# EasyEDA Pro project ProProject_12v转5v稳压_2024-07-26.epro

# Schematic Schematic1
Create Date: 2024-07-26; Page Name: P1; Project Name: 12v转5v稳压; Schematic Name: Schematic1; Update Date: 2024-07-26; Company: 嘉立创EDA; Page Size: A4; Version: V1.0
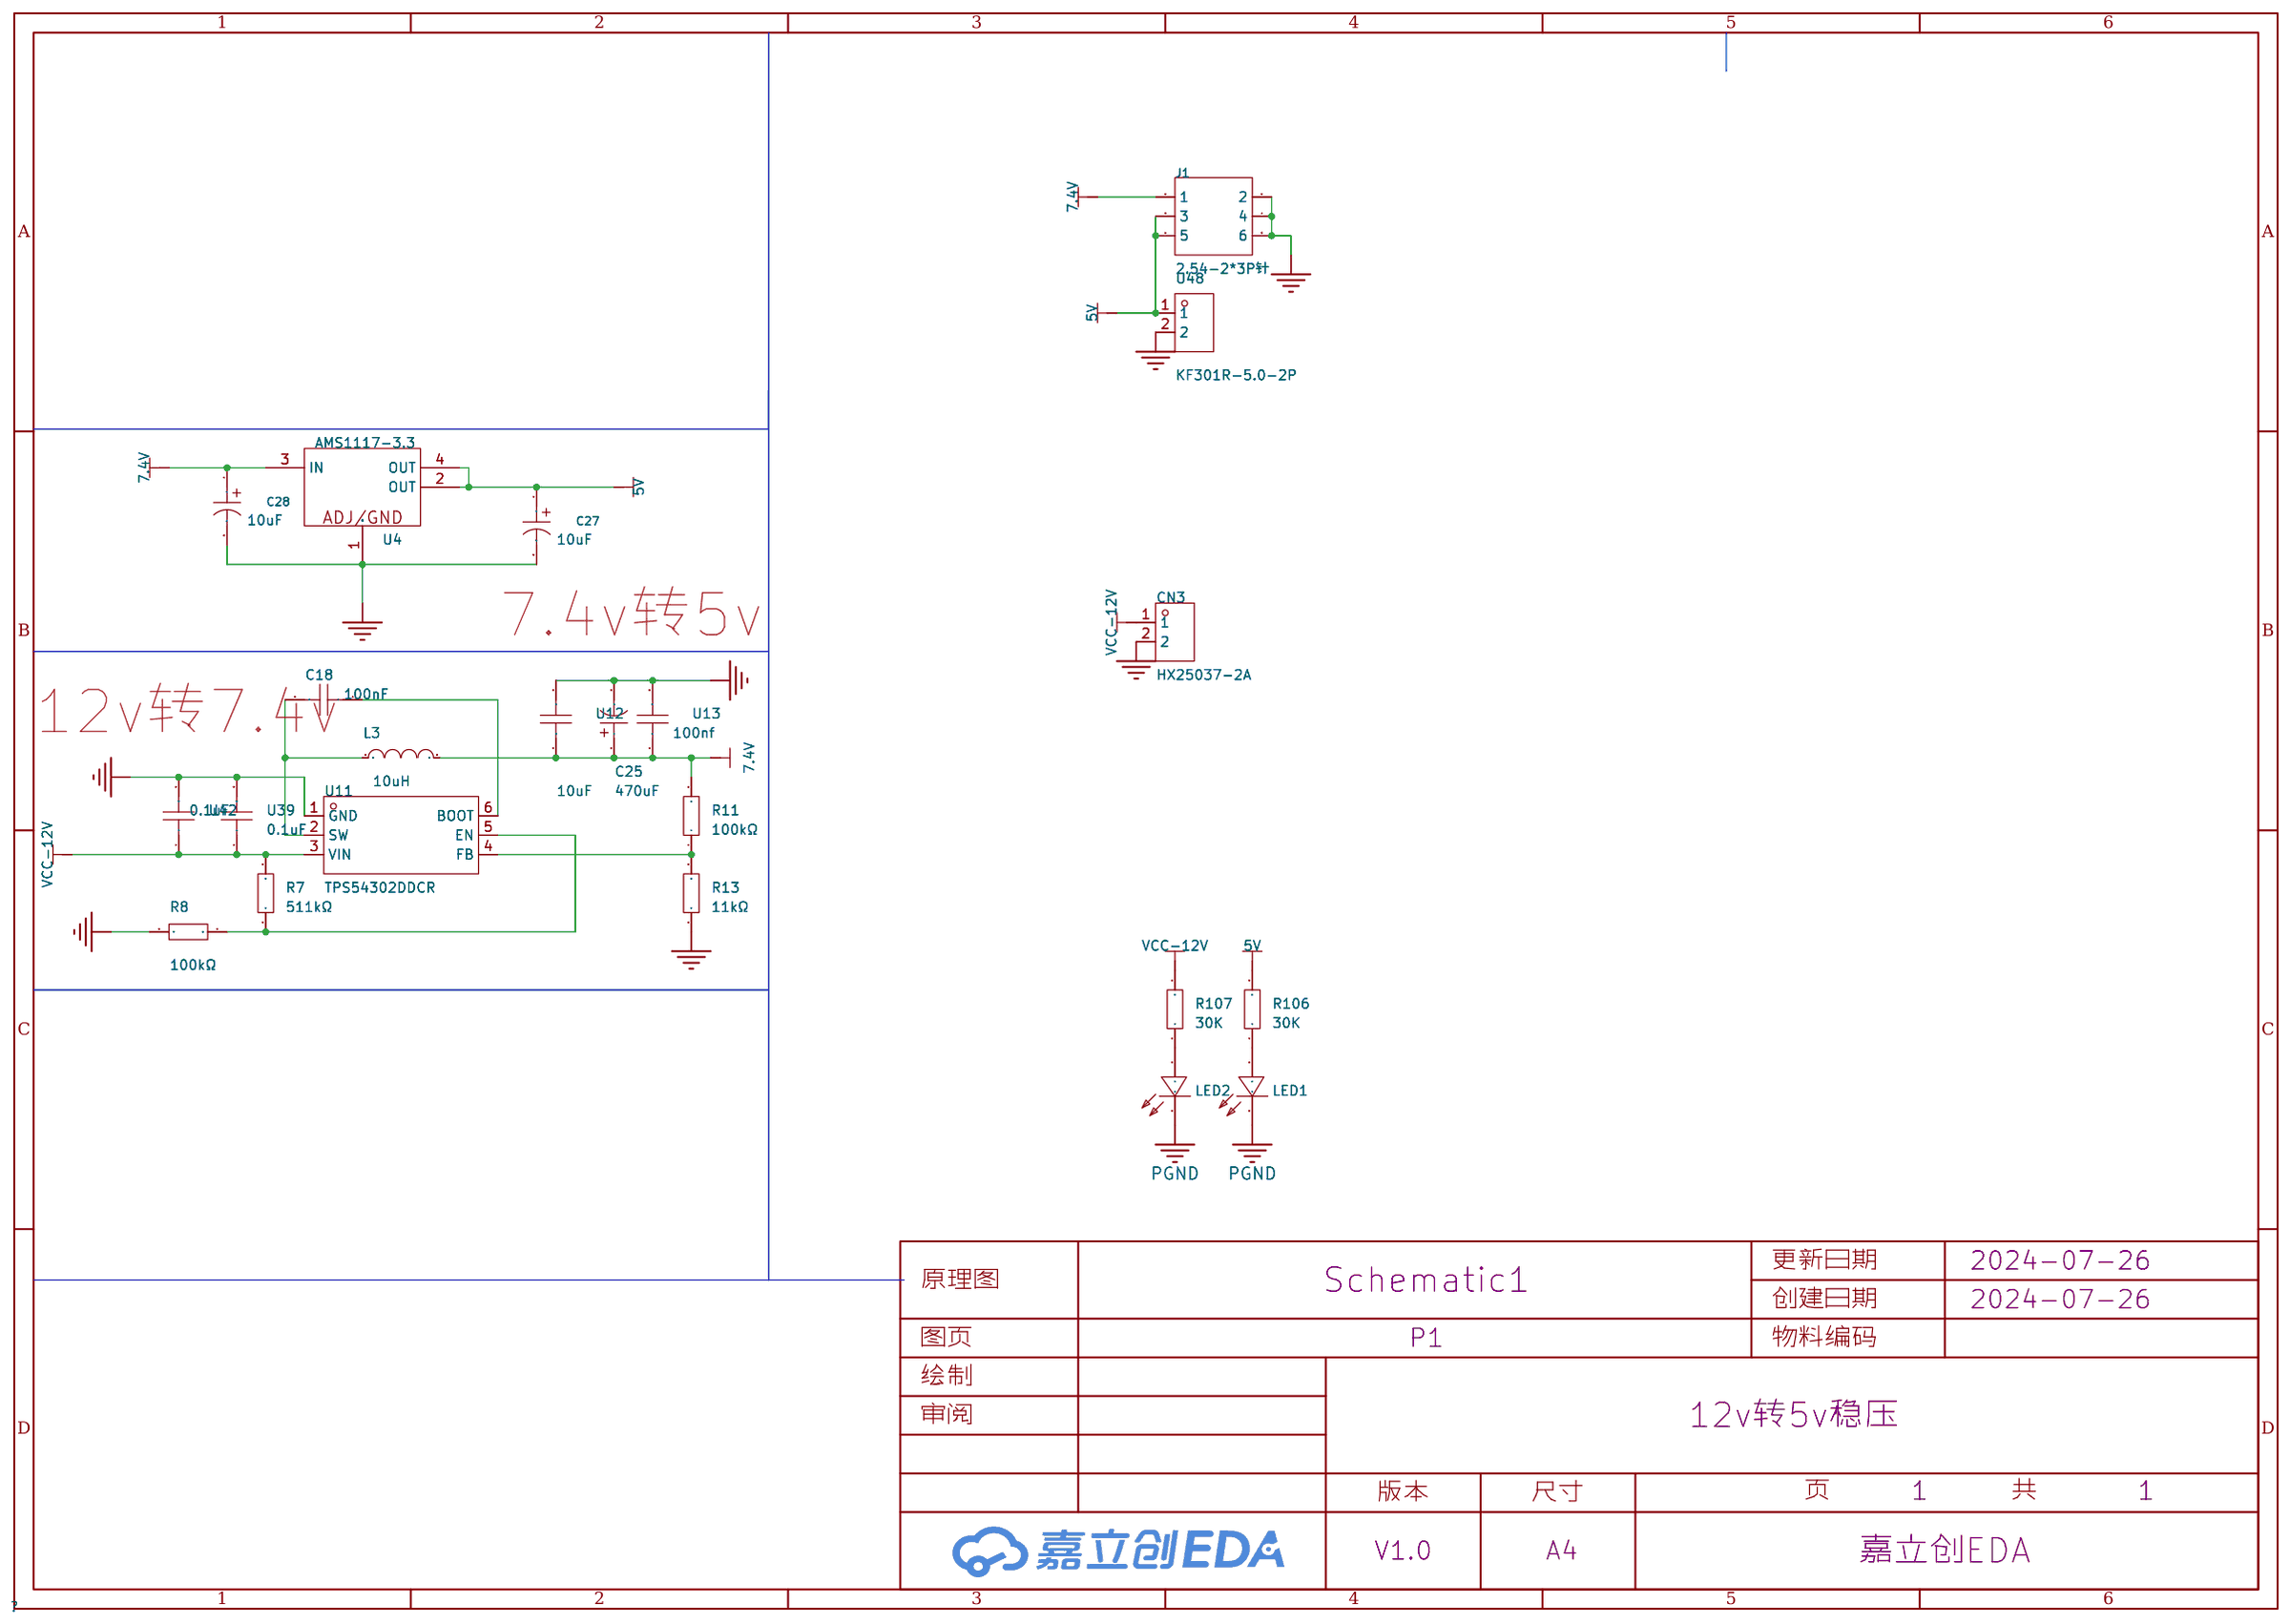
[diagram p0: schematic sheet]

## Parts
C18  100nF  [C0603]
C25  470uF  [CAP-SMD_BD10.0-L10.3-W10.3-LS11.3-FD]
C27  10uF  [CAP-SMD_L1.6-W0.9-FD]
C28  10uF  [CAP-SMD_L1.6-W0.9-FD]
CN3  HX25037-2A  [CONN-TH_2P-P2.50-XH2.54-2P]
J1  2.54-2*3P针  [HDR-TH_6P-P2.54-V-M-R2-C3-S2.54-1]
L3  10uH  [IND-SMD_L5.4-W5.2_FXL0530]
LED1  NCD0603R3  [LED0603-R-RD_RED]
LED2  NCD0603R3  [LED0603-R-RD_RED]
R7  511kΩ  [R0603]
R8  100kΩ  [R0603]
R11  100kΩ  [R0603]
R13  11kΩ  [R0603]
R106  30K  [R0603]
R107  30K  [R0603]
U4  AMS1117-3.3  [SOT-223-3_L6.4-W3.5-P2.30-LS7.0-BR]
U11  TPS54302DDCR  [SOT-23-6_L2.9-W1.6-P0.95-LS2.8-BL]
U12  10uF  [C0603]
U13  100nf  [C0603]
U39  0.1uF  [C0603]
U42  0.1uF  [C0603]
U48  KF301R-5.0-2P  [CONN-TH_P5.00_KF301R-5.0-2P]

## Library data of the parts
C18 = CC0603KRX7R9BB104: 容值:100nF;精度:±10%;额定电压:50V;材质(温度系数):X7R;; LCSC Part Name: 100nF ±10% 50V; Supplier Part: C14663; Manufacturer: YAGEO(国巨); Supplier Footprint: 0603; JLCPCB Part Class: 基础库; Datasheet: https://atta.szlcsc.com/upload/public/pdf/source/20170116/1484561234239.pdf; Supplier: LCSC; Tolerance: ±10%; Voltage Rated: 50V; Temperature Coefficient: X7R
C25 = XT470UF35V90RV0080: 容值:470uF;额定电压:35V;电容体直径:-;电容体长度:-;纹波电流:-;等效串联电阻:-;工作寿命:-;; LCSC Part Name: 470uF 35V; Supplier Part: C2992611; Manufacturer: KNSCHA(科尼盛); Supplier Footprint: SMD,D10xL10.5mm; JLCPCB Part Class: 扩展库; Datasheet: https://atta.szlcsc.com/upload/public/pdf/source/20220628/C969EE689908AD9C2F3DF9F92FD62901.pdf; Supplier: LCSC; Rated Voltage: 35V
C27 C28 = TCM1A106M8R: 容值:10uF;精度:±20%;额定电压:10V;等效串联电阻:9Ω;; LCSC Part Name: 10uF ±20% 10V; Supplier Part: C962635; Manufacturer: ROHM(罗姆); Supplier Footprint: 0603; JLCPCB Part Class: 扩展库; Datasheet: https://atta.szlcsc.com/upload/public/pdf/source/20201126/C962635_8046D3B05AD53548D8FD41E170F2F4AB.pdf; Supplier: LCSC; Tolerance: ±20%; Rated Voltage: 10V; Equivalent Series Resistance(ESR): 9Ω; Operating Temperature: -55℃~+125℃
CN3 = HX25037-2A: Supplier Part: C9900012767; Supplier Footprint: XHB2.54-2P; JLCPCB Part Class: 扩展库; Supplier: LCSC
J1 = 2.54-2*3P针: 插针结构:-;间距:2.54mm;行距:-;圆针/方针:-;安装类型:直插;排数:双排;总PIN位数:6P;额定电流:-;额定电压:-;配合针长度:-;塑高:-;触头材质:-;触头镀层:-;颜色:黑色;; LCSC Part Name: 间距:2.54mm 直插; Supplier Part: C65114; Manufacturer: BOOMELE(博穆精密); Supplier Footprint: 插件,P=2.54mm; JLCPCB Part Class: 扩展库; Supplier: LCSC; Pitch: 2.54mm; Mounting Type: 直插; Number of Rows: 双排; Number of Pins: 6P; Color: 黑色
L3 = FXL0530-4R7-M: 电感值:4.7uH;精度:±20%;额定电流:4.5A;饱和电流(Isat):5A;直流电阻(DCR):50mΩ;; LCSC Part Name: 4.7uH ±20% 4.5A 50mΩ; Supplier Part: C177246; Manufacturer: cjiang(长江微电); Supplier Footprint: SMD,5.4x5.2x2.8mm; JLCPCB Part Class: 扩展库; Datasheet: https://atta.szlcsc.com/upload/public/pdf/source/20190322/C177246_D81D0671B72FD9DE4B58607F480A6AE0.pdf; Supplier: LCSC; Tolerance: ±20%; Rated Current: 4.5A; Saturation Current (Isat): 5A; DC Resistance (DCR): 50mΩ
LED1 LED2 = NCD0603R3: 尺寸1.6x0.8x0.8；IF=20ma：1.6~2.6v，620~640nm,51~150mcd金线，光强高，功耗低，可靠性好，寿命长; LCSC Part Name: 红色;贴片LED;0603红灯;; Supplier Part: C3151730; Manufacturer: 国星光电; Supplier Footprint: 0603; JLCPCB Part Class: 扩展库; Datasheet: https://atta.szlcsc.com/upload/public/pdf/source/20220704/CBFF28C1847A97213A75929E60B7DDE7.pdf; Supplier: LCSC
R7 = RS-03K5113FT: 电阻类型:厚膜电阻;阻值:511kΩ;精度:±1%;功率:100mW;最大工作电压:50V;温度系数:±100ppm/℃;; LCSC Part Name: 厚膜电阻 511kΩ ±1% 100mW; Supplier Part: C321933; Manufacturer: FH(风华); Supplier Footprint: 0603; JLCPCB Part Class: 扩展库; Datasheet: https://atta.szlcsc.com/upload/public/pdf/source/20140616/1457707091974.pdf; Supplier: LCSC; Type: 厚膜电阻; Tolerance: ±1%; Power(Watts): 100mW; Overload Voltage (Max): 50V; Temperature Coefficient: ±100ppm/℃; Operating Temperature Range: -55℃~+155℃
R8 = ERJ3EKF1003V: 电阻类型:厚膜电阻;阻值:100kΩ;精度:±1%;功率:100mW;最大工作电压:-;温度系数:±100ppm/℃;; LCSC Part Name: 100kΩ ±1% 100mW 厚膜电阻; Supplier Part: C189597; Manufacturer: PANASONIC(松下); Supplier Footprint: 0603; JLCPCB Part Class: 扩展库; Datasheet: https://atta.szlcsc.com/upload/public/pdf/source/20180524/C193239_FFEA89BB7F9859C8C42240F47AD03C60.pdf; Supplier: LCSC; Type: 厚膜电阻; Tolerance: ±1%; Power(Watts): 100mW; Temperature Coefficient: ±100ppm/℃; Operating Temperature Range: -55℃~+155℃
R11 = RC0603FR-07100KL: 电阻类型:厚膜电阻;阻值:100kΩ;精度:±1%;功率:100mW;最大工作电压:75V;温度系数:±100ppm/℃;; LCSC Part Name: 厚膜电阻 100kΩ ±1% 100mW; Supplier Part: C14675; Manufacturer: YAGEO(国巨); Supplier Footprint: 0603; JLCPCB Part Class: 扩展库; Datasheet: https://atta.szlcsc.com/upload/public/pdf/source/20140324/1457707028752.pdf; Supplier: LCSC; Type: 厚膜电阻; Tolerance: ±1%; Power(Watts): 100mW; Overload Voltage (Max): 75V; Temperature Coefficient: ±100ppm/℃; Operating Temperature Range: -55℃~+155℃
R13 = 0603WAF1102T5E: 电阻类型:厚膜电阻;阻值:11kΩ;精度:±1%;功率:100mW;最大工作电压:75V;温度系数:±100ppm/℃;; LCSC Part Name: 11kΩ ±1% 100mW 厚膜电阻; Supplier Part: C25950; Manufacturer: UNI-ROYAL(厚声); Supplier Footprint: 0603; JLCPCB Part Class: 扩展库; Datasheet: https://atta.szlcsc.com/upload/public/pdf/source/20200306/C422600_1E6D84923E4A46A82E41ADD87F860B5C.pdf; Supplier: LCSC; Type: 厚膜电阻; Tolerance: ±1%; Power(Watts): 100mW; Overload Voltage (Max): 75V; Temperature Coefficient: ±100ppm/℃; Operating Temperature Range: -55℃~+155℃
R106 R107 = Res_0603: Supplier Footprint: 0603
U4 = AMS1117-3.3_C2992570: Supplier Part: C2992570; Manufacturer: 国芯佳品; Supplier Footprint: SOT-223-3; JLCPCB Part Class: 扩展库; Datasheet: https://atta.szlcsc.com/upload/public/pdf/source/20220729/0D21C21EC310E4778671BF6BAE438640.pdf; Supplier: LCSC
U11 = TPS54302DDCR: 功能类型:降压型;输出类型:可调;输入电压:4.5V~28V;输出电压:596mV~28V;输出电流(最大值):3A;; Supplier Part: C311983; Manufacturer: TI(德州仪器); Supplier Footprint: TSOT-23-6; JLCPCB Part Class: 扩展库; Datasheet: https://www.ti.com/cn/lit/gpn/tps54302; Supplier: LCSC; Function: 降压型; Output Type: 可调; Input Voltage: 4.5V~28V; Output Voltage: 596mV~28V; Output Current (Max): 3A; Switching Frequency: 400kHz; Operating Temperature: -40℃~+125℃@(TJ); Synchronous Rectification: 是; Number of Outputs: 1; Topology: 降压式; Switch tube (built-in/external): 内置
U12 U13 U39 U42 = GRM188R60G226MEA0D: 容值:22uF;精度:±20%;额定电压:4V;材质(温度系数):X5R;; LCSC Part Name: 22uF ±20% 4V; Supplier Part: C913769; Manufacturer: muRata(村田); Supplier Footprint: 0603; JLCPCB Part Class: 扩展库; Datasheet: https://atta.szlcsc.com/upload/public/pdf/source/20201110/C913769_6831C109DC3770F1CE6407BEC357A4ED.pdf; Supplier: LCSC; Tolerance: ±20%; Voltage Rated: 4V; Temperature Coefficient: X5R
U48 = KF301R-5.0-2P: 结构:1x2P;间距:5mm;颜色:蓝色;安装方式:弯插;额定电流:17A;额定电压:250V;排数:1;线规 - AWG:14~22;线规 - 平方毫米:1.5;每排PIN数:2;工作温度范围:-30℃~+120℃;; LCSC Part Name: 5mm 1x2P 排数:1 每排P数:2 弯插; Supplier Part: C474883; Manufacturer: KEFA(科发); Supplier Footprint: 弯插,P=5mm; JLCPCB Part Class: 扩展库; Datasheet: https://atta.szlcsc.com/upload/public/pdf/source/20230317/849DD4A15FCDE8E7FA4A1DB3DFDC5FF4.pdf; Supplier: LCSC; Structure: 1x2P; Pitch: 5mm; Color: 蓝色; Mounting Style: 弯插; Current Rating (Max): 17A; Voltage Rating (Max): 250V; Number of Pins: 2P; Number of Rows: 1; Wire Gauge - AWG: 14~22; Wire Gauge - mm2: 1.5; Number of PINs Per Row: 2; Operating Temperature Range: -30℃~+120℃

## Nets
5V: C27.1 J1.3 J1.5 R106.2 U4.2(OUT) U4.4(OUT) U48.1
7.4V: C25.1 C28.1 J1.1 L3.2 R11.2 U4.3(IN) U12.1 U13.1
GND: CN3.2
PGND: C25.2 C27.2 C28.2 J1.2 J1.4 J1.6 LED1.2(K) LED2.2(K) R8.2 R13.1 U4.1(ADJ/GND) U11.1(GND) U12.2 U13.2 U39.2 U42.2 U48.2
VCC-12V: CN3.1 R7.2 R107.2 U11.3(VIN) U39.1 U42.1
$1N3633: R7.1 R8.1 U11.5(EN)
$1N3799: C18.1 U11.6(BOOT)
$1N3839: C18.2 L3.1 U11.2(SW)
$1N3988: R11.1 R13.2 U11.4(FB)
$1N14940: LED1.1(A) R106.1
$1N15092: LED2.1(A) R107.1

## Notes on the sheet
- 7.4v转5v
- 12v转7.4v

# Board PCB1
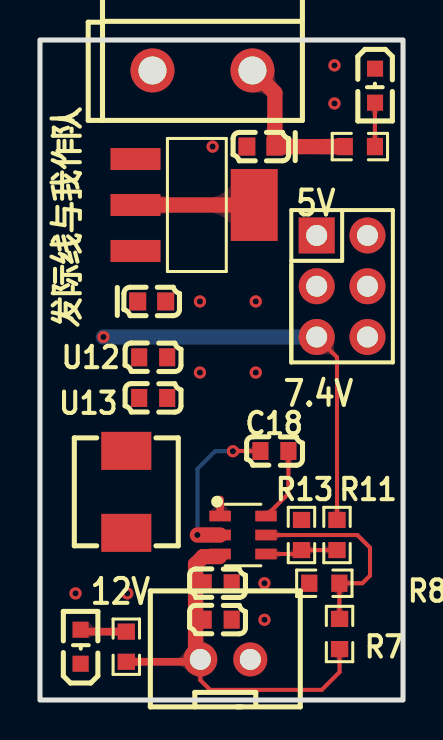
[diagram p1: board, top side]
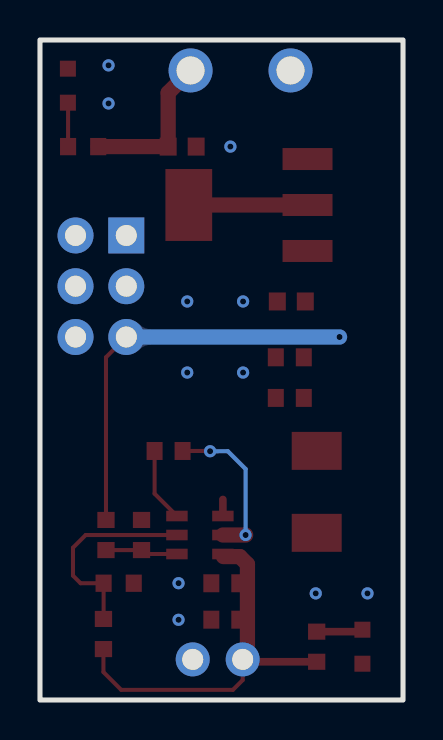
[diagram p2: board, bottom side, seen from below]

Outline 18.16 x 33.02 mm; copper layers: Top Layer, Bottom Layer. Coordinates in mm from the lower left corner of the outline.
Outline path: rectangle 0,33.02 18.16,0
Stack: Top Layer 0.035mm / Dielectric1 1.51mm FR4 er 4.5 / Bottom Layer 0.035mm

## Design rules (mm)
template: 自定义配置
spacing copperThickness1oz (default): track to track 0.203, other pairs 0.203 to 0.203
spacing copperThickness2oz: track to track 0.203, other pairs 0.152 to 0.3
track width copperThickness1oz (default): min 0.152, default 0.203, max 0.762
track width copperThickness2oz: min 0.203, default 0.254, max 2.54
track width VCC: min 0.203, default 0.762, max 0.762
differential pair differentialPair (default): width min 0.127, default 0.254, max 2.54; gap min 0.152, default 0.152
via viaSize (default): diameter min 0.5, default 0.61, max 10; hole min 0.3, default 0.305, max 6.299
net 5V uses VCC, copperRegion1
net PGND uses VCC, copperRegion1
net $1N3839 uses copperRegion1
net VCC-12V uses copperRegion1
net 7.4V uses copperRegion1

## Placement (name value [footprint] x y rotation side)
C18  100nF  [C0603]  11.73 12.46 180 top
C27  10uF  [CAP-SMD_L1.6-W0.9-FD]  11.05 27.69 180 top
C28  10uF  [CAP-SMD_L1.6-W0.9-FD]  5.59 19.94 0 top
CN3  HX25037-2A  [CONN-TH_2P-P2.50-XH2.54-2P]  9.27 2.03 180 top
J1  2.54-2*3P针  [HDR-TH_6P-P2.54-V-M-R2-C3-S2.54-1]  15.11 20.7 270 top
L3  10uH  [IND-SMD_L5.4-W5.2_FXL0530]  4.32 10.41 90 top
LED1  NCD0603R3  [LED0603-R-RD_RED]  16.76 30.73 270 top
LED2  NCD0603R3  [LED0603-R-RD_RED]  2.03 2.67 90 top
R7  511kΩ  [R0603]  14.99 3.3 270 top
R8  100kΩ  [R0603]  14.22 5.84 180 top
R11  100kΩ  [R0603]  14.86 8.25 90 top
R13  11kΩ  [R0603]  13.08 8.25 270 top
R106  30K  [R0603]  16 27.69 180 top
R107  30K  [R0603]  4.32 2.67 270 top
U4  AMS1117-3.3  [SOT-223-3_L6.4-W3.5-P2.30-LS7.0-BR]  7.75 24.77 180 top
U11  TPS54302DDCR  [SOT-23-6_L2.9-W1.6-P0.95-LS2.8-BL]  10.16 8.25 270 top
U12  10uF  [C0603]  5.66 17.14 0 top
U13  100nf  [C0603]  5.66 15.11 0 top
U42  0.1uF  [C0603]  8.89 5.84 0 top
U42#2  -  [C0603]  8.89 4.02 0 top
U48  KF301R-5.0-2P  [CONN-TH_P5.00_KF301R-5.0-2P]  8.13 31.5 180 top

## Footprints (pads in the part's own frame, mm; a bottom-side part is the same pattern mirrored in y, then rotated)
C0603
  rect 0.8x0.9 smd: 1(-0.7,0) 2(0.7,0)
CAP-SMD_L1.6-W0.9-FD
  rect 0.85x0.9 smd: 1(-0.7,0) 2(0.7,0)
CONN-TH_2P-P2.50-XH2.54-2P
  round 1.7 hole 1.05: 1(1.25,0) 2(-1.25,0)
CONN-TH_P5.00_KF301R-5.0-2P
  round 2.2 hole 1.4: 1(-2.5,0) 2(2.5,0)
HDR-TH_6P-P2.54-V-M-R2-C3-S2.54-1
  rect 1.8x1.8 hole 1.05: 1(-2.54,-1.27)
  round 1.8 hole 1.05: 2(-2.54,1.27) 3(0,-1.27) 4(0,1.27) 5(2.54,-1.27) 6(2.54,1.27)
IND-SMD_L5.4-W5.2_FXL0530
  rect 1.9x2.5 smd: 1(-2.05,0) 2(2.05,0)
LED0603-R-RD_RED
  rect 0.8x0.8 smd: 1(0.851,0) 2(-0.851,0)
R0603
  rect 0.806x0.864 smd: 1(-0.753,0) 2(0.753,0)
SOT-23-6_L2.9-W1.6-P0.95-LS2.8-BL
  rect 0.532x1.072 smd: 1(-0.95,-1.149) 2(0,-1.149) 3(0.95,-1.149) 4(0.95,1.149) 5(0,1.149) 6(-0.95,1.149)
SOT-223-3_L6.4-W3.5-P2.30-LS7.0-BR
  rect 2.499x1.1 smd: 1(2.97,-2.299) 2(2.97,0) 3(2.97,2.301)
  rect 2.34x3.599 smd: 4(-2.97,0)

## Nets
5V: C27.1 J1.1 J1.3 R106.2 U4.2 U4.4 U48.1
7.4V: C28.1 J1.5 L3.2 R11.2 U4.3 U12.1 U13.1
PGND: C27.2 C28.2 CN3.2 J1.2 J1.4 J1.6 LED1.2 LED2.2 R8.2 R13.1 U4.1 U11.1 U12.2 U13.2 U42.2 U42#2.2 U48.2
VCC-12V: CN3.1 R7.2 R107.2 U11.3 U42.1 U42#2.1
$1N3633: R7.1 R8.1 U11.5
$1N3799: C18.1 U11.6
$1N3839: C18.2 L3.1 U11.2
$1N3988: R11.1 R13.2 U11.4
$1N14940: LED1.1 R106.1
$1N15092: LED2.1 R107.1

## Via types
v1: diameter 0.61, hole 0.305, Top Layer to Bottom Layer, 14 vias

## Routing (per net, layer and track width the routed paths; a pad name or vN(x,y) marks a point on that pad's centre or on a via; arc(x,y) is an arc through that point)
5V: length 13.7
  Top Layer w0.762: U48.1 11.75,30.38 C27.1 R106.2 ; U4.2 U4.4
7.4V: length 20.4
  Top Layer w0.203: J1.5 14.86,17.14 R11.2
  Bottom Layer w0.762: 13.84,17.78 13.46,18.16 v1(3.18,18.16)
PGND: length 0.8
  Top Layer w0.381: U11.1 9.01,10.03
  vias: v1(1.78,5.33) v1(4.37,5.33) v1(8,19.94) v1(8,16.38) v1(8.64,27.69) v1(10.79,19.94) v1(10.79,16.38) v1(11.23,5.84) v1(11.23,4.01) v1(14.73,31.75) v1(14.73,29.84)
VCC-12V: length 19.7
  Top Layer w0.203: R7.2 14.99,1.4 14.1,0.51 8.51,0.51 8.02,1 CN3.1
  Top Layer w0.381: CN3.1 7.9,1.91 R107.2
  Top Layer w0.762: CN3.1 7.78,2.27 7.78,6.79 8.16,7.18 8.98,7.18
$1N3633: length 10.3
  Top Layer w0.203: R7.1 14.98,4.06 R8.1 16.13,5.84 16.51,6.22 16.51,7.62 15.88,8.25 U11.5
$1N3799: length 3.7
  Top Layer w0.203: C18.1 12.43,10.32 U11.6
$1N3839: length 8
  Top Layer w0.203: C18.2 9.66,12.46 v1(9.65,12.45)
  Top Layer w0.762: U11.2 v1(7.87,8.25)
  Bottom Layer w0.203: v1(7.87,8.25) 7.87,11.56 8.76,12.45 v1(9.65,12.45)
$1N3988: length 3.6
  Top Layer w0.203: U11.4 12.88,7.3 R13.2 R11.1
$1N14940: length 2.2
  Top Layer w0.203: R106.1 16.76,29.76 16.64,29.88
$1N15092: length 2.3
  Top Layer w0.381: LED2.1 2.13,3.42 R107.1

## Copper pours and planes (outline as drawn; the poured copper is in the pictures)
5V on Top Layer: 11.21,22.97 12.26,22.97 12.26,28.78 11.21,28.78
5V on Top Layer: 12.83,19.64 15.11,19.64 15.11,28.45 12.83,28.45
7.4V on Top Layer: 2.41,23.24 5.66,23.24 5.66,11.05 2.41,11.05
PGND on Top Layer: -0.63,-0.38 18.54,-0.38 18.54,33.53 -0.63,33.53
PGND on Bottom Layer: 0,0.16 18.54,0.16 18.54,33.02 0,33.02
VCC-12V on Top Layer: 6.61,1.04 8.89,1.04 8.89,7.33 6.61,7.33
$1N3839 on Top Layer: 2.67,9.29 2.67,7.24 3.18,6.73 5.38,6.73 6.36,7.71 9.03,7.71 9.36,8.04 9.36,8.47 9.06,8.76 6.48,8.76 5.46,9.78 3.16,9.78

Small or netless copper shapes (teardrops, artwork), in the pictures only: 33 on Top Layer, 3 on Bottom Layer

## Text on the board
Top Silkscreen Layer: 7.4V | 5V | 12V | 发际线与我作队
